# Altium schematic sheet 1_Power.SchDoc
size A4; SheetNumber: 2; SheetTotal: 6
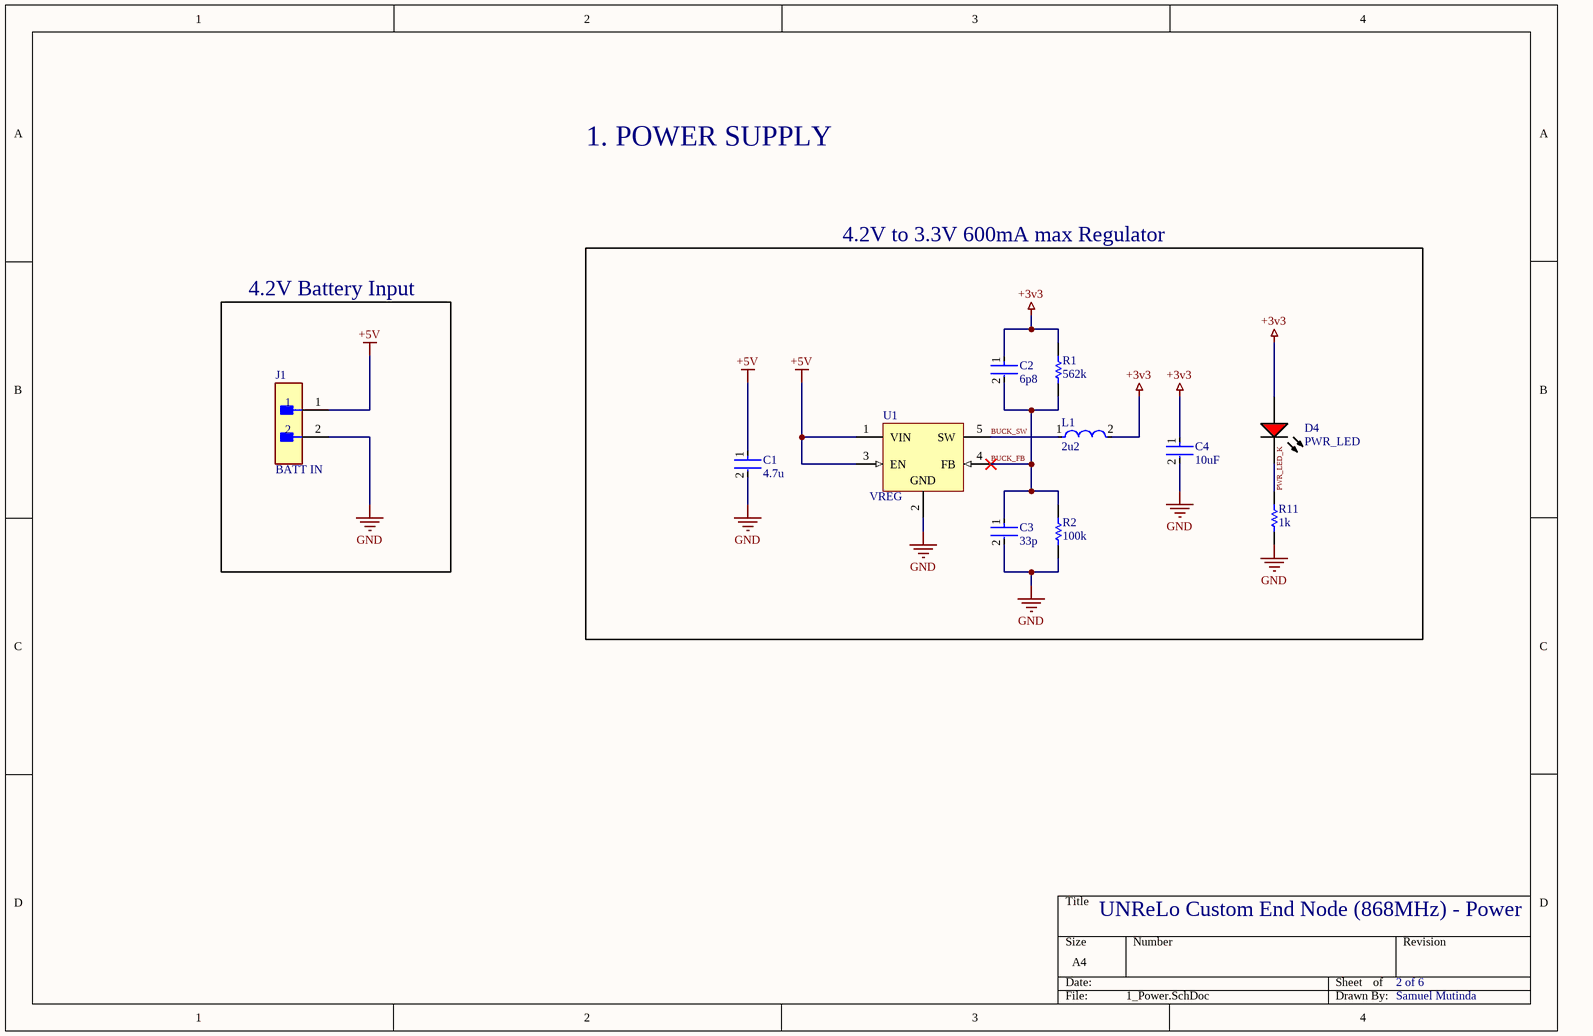
[diagram p0: 1_Power.SchDoc]

## Parts
C1  4.7u  [FP-GRM155-0_1-IPC_B]
C2  6p8  [FP-C0603C-CF-MFG]
C3  33p  [FP-CC0603-0_9-IPC_C]
C4  10uF  [FP-GRM188-0_1-e0_2_0_55-IPC_A]
D4  PWR_LED  [VISH-TLMS1000_V]
J1  BATT IN  [FP-53254-0270-MFG]
L1  2u2  [FP-LQM21PH_G0-IPC_C]
R1  562k  [RESC1609X50X30NL10T20]
R2  100k  [RESC1608X55X30ML20T20]
R11  1k  [RESC1005X40X25NL05T05]
U1  VREG  [DBV0005A_L]

## Blocks framed on the sheet
4.2V Battery Input: J1
4.2V to 3.3V 600mA max Regulator: C1-C4 D4 L1 R1 R2 R11 U1

## Nets
+3v3: C2.1 C4.1 D4.1(A) L1.2 R1.2
+5V: C1.1 J1.1 U1.1(VIN) U1.3(EN)
GND: C1.2 C3.2 C4.2 J1.2 R2.1 R11.1 U1.2(GND)
BUCK_FB: C2.2 C3.1 R1.1 R2.2 U1.4(FB)
BUCK_SW: L1.1 U1.5(SW)
PWR_LED_K: D4.2(K) R11.2

## Notes on the sheet
- 1. POWER SUPPLY
- UNReLo Custom End Node (868MHz) - Power
- 2 of 6
- Samuel Mutinda

## Library data of the parts
C1 = CMP-2008-04549-2: Chip Multilayer Ceramic Capacitors for General Purpose, 0402, 4.7uF, X5R, 15%, 20%, 6.3V; Manufacturer 1: Samsung Electro-Mechanics; Voltage Rating (DC): 16V; Name: CL05A475MO5NUNC; Height: 0.5mm; Weight: 0.000212oz; Length: 1mm; Case Code (Metric): 1005; Packaging: Tape and Reel; Termination: SMD/SMT; Dielectric: X5R; Depth: 0.5mm; Case Code (Imperial): 0402; Min Operating Temperature: -55°C; Case/Package: 0402; Voltage: 6.3V; Width: 0.02inch; Capacitance: 4.7uF; Lead Free: Lead Free; Thickness: 0.022inch; Contact Plating: Tin; REACH SVHC: No SVHC; Package Quantity: 10000; Tolerance: 20%; Voltage Rating: 16V; Mount: Surface Mount; Max Operating Temperature: 85°C; Manufacturer Part Number 1: CL05A475MO5NUNC; Supplier 1: Digi-Key; Supplier Part Number 1: 1276-6836-1-ND; Supplier Unit Price 1: $0.44
C2 = CMP-2006-03271-2: CAP CER 6.8PF 50V NP0 0603; Manufacturer Part Number: C0603C689C5GACTU; Manufacturer: KEMET; Manufacturer 1: TDK Corporation; Manufacturer Part Number 1: C1608CH2A6R8D080AA; Automotive Grade: Grade 1; Temperature Coefficient: 30ppm/°C; Temperature Characteristic: C0G; Tolerance: 0.25 pF; Material: Ceramic; Voltage Rating: 100 V; ComponentLink2URL: https://api.kemet.com/component-edge/download/datasheet/C0603C100J5GACAUTO.pdf; Mouser Description: 0603 C 6.8pF Ceramic Multilayer Capacitor; 50V dc; +125C; C0G Dielectric; +/-0.25pF; Temperature Range High: +125°C; Device Class L1: Passive Components; Temperature: -55°C to +125°C; Digikey Description: CAP CER 6.8PF 50V NP0 0603; Device Class L2: Capacitors; Automotive: Yes; Octopart: https://octopart.com/c0603c689c5gactu-kemet-8718591; Category: Cap; ComponentLink2Description: Datasheet; RoHS: TRUE; Capacitance: 6.8 pF; Value: 6.8 pF; Lead Free: Yes; Device Class L3: Ceramic Capacitors; Package: C0603C-CF; Temperature Range Low: -55°C; Height: 0.87mm; Supplier 1: Digi-Key; Supplier Unit Price 1: $0.14; Supplier Part Number 1: 445-11157-1-ND; Name: C1608CH2A6R8D080AA
C3 = CMP-2000-06072-2: CAP CER 33PF 50V C0G/NPO 0603; Manufacturer 1: KEMET; Manufacturer Part Number 1: C0603H330J5GAC7867; Tolerance: 5%; Temperature Coefficient: 30ppm/°C; Dielectric: C0G; Insulation Resistance: 100GR; Dielectric Material: Ceramic; Voltage Rating (DC): 50V; Capacitance: 33pF; Voltage: 50V; Resistor Type: Ceramic; Lead Free: Lead Free; Mount: Surface Mount; Case Code (Imperial): 0603; Min Operating Temperature: -55°C; Package Quantity: 1; Case Code (Metric): 1608; Radiation Hardening: No; Packaging: Tape and Reel; Length: 1.6mm; Width: 0.031inch; Termination: SMD/SMT; Max Operating Temperature: 125°C; Series: CC; Case/Package: 0603; RoHS Compliant: Yes; Number of Pins: 2; REACH SVHC: No SVHC; Thickness: 0.035inch; Depth: 0.8mm; Voltage Rating: 50V; Height: 0.8mm; Supplier 1: Digi-Key; Supplier Unit Price 1: 0.76; Supplier Part Number 1: 399-17603-1-ND; Name: C0603H330J5GAC7867
C4 = CMP-2006-02792-2: 10 µF ±10% 10V Ceramic Capacitor X5R 0603 (1608 Metric); Manufacturer 1: Murata Electronics; Manufacturer Part Number 1: GRT188R61A106KE13D; Voltage: 6.3V; Tolerance: 20%; Packaging: Tape and Reel; Voltage Rating (DC): 10V; Width: 0.031inch; Termination: SMD/SMT; Dielectric: X5R; Package Quantity: 4000; Voltage Rating: 10V; Capacitance: 10uF; Case/Package: 0603; Min Operating Temperature: -55°C; Length: 1.6mm; Thickness: 0.035inch; Lead Free: Lead Free; Depth: 0.8mm; Case Code (Imperial): 0603; Max Operating Temperature: 85°C; Material: Ceramic; Height: 0.8mm; Mount: Surface Mount; REACH SVHC: No SVHC; Radiation Hardening: No; Case Code (Metric): 1608; Supplier 1: Digi-Key; Supplier Unit Price 1: $0.36; Supplier Part Number 1: 490-12311-1-ND; Name: GRT188R61A106KE13D
D4 = CMP-2000-07254-1: Low Current LED, 40 mW, 1.8 V, -40 to 100 degC, 2-Pin SMD (0603), RoHS, Tape and Reel; Manufacturer: Vishay; Lens Shape: Rectangular; Automotive Qualification Standard: AEC-Q100; Wavelength Typ: 636nm; SVHC: ToBeAdvised; LED Colour: Red; Bulb Size: 1.6mmx0.8mm; Forward Voltage: 1.8V; Luminous Intensity: 4mcd; Forward Current If: 2mA; Viewing Angle: 80°; JLCPCB Part #: C2286; Datasheet URL: https://datasheet.ciiva.com/5798/1698881-5798337.pdf; LED Mounting: SMD; Packaging: CutTape; Package Reference: TLMS1000; Manufacturer URL: http://www.vishay.com/; Mounting Technology: SurfaceMount; Product Range: -; Package Description: 2-Pin Surface Mount Device, Body 1.6 x 0.8 mm; MSL: MSL2-1year
J1 = CMP-04776-000342-1: CONN HEADER R/A 2POS 2MM; Manufacturer 1: Sullins Connector Solutions; Max Current Rating: 3A; Max Voltage Rating (DC): 250V; Number of Positions: 2; Voltage Rating: 125V; Contact Resistance: 20mR; Gender: Male; Current Rating: 2A; Glow Wire Compliant: Non-compliant; Name: SWR201-NRTN-S02-RL-WH; Series: 53254; Packaging: Tray; Max Operating Temperature: 105°C; Depth: 13.59mm; Contact Plating: Tin; Orientation: Right Angle; Number of Circuits: 2; Number of Contacts: 2; Termination: Through Hole; Radiation Hardening: No; Max Voltage Rating (AC): 125V; Min Operating Temperature: -40°C; Housing Material: Nylon; Housing Color: Black; RoHS Compliant: Yes; Number of Rows: 1; Length: 11.07mm; Package Quantity: 2000; Contact Material: Brass; Mount: Through Hole; Contact Gender: Male; Pitch: 2mm; Height: 6.99mm; Manufacturer Part Number 1: SWR201-NRTN-S02-RL-WH; Supplier 1: Digi-Key; Supplier Part Number 1: S9443-ND; Supplier Unit Price 1: $0.13
L1 = CMP-06042-016317-1: 2.2 µH Unshielded Multilayer Inductor 900 mA 170mOhm Max 0806 (2016 Metric); Manufacturer 1: Walsin Technology Corporation; Manufacturer Part Number 1: WLFM201209M2R2PC; Test Frequency: 1MHz; Inductance Tolerance: 30%; Current Rating: 800mA; Self Resonant Frequency: 40MHz; Core Material: Ferrite; Inductance: 2.2uH; DC Resistance (DCR): 288mR; RoHS Compliant: Yes; REACH SVHC: No SVHC; Package Quantity: 4000; Military Standard: Not; Max Operating Temperature: 125°C; Radiation Hardening: No; Series: LQM; Height - Seated (Max): 0.039inch; Tolerance: 30%; Shielding: Shielded; Height: 0.9mm; Lead Free: Lead Free; Case Code (Metric): 2012; Packaging: Tape and Reel; Termination: SMD/SMT; Case Code (Imperial): 0805; Min Operating Temperature: -55°C; Depth: 1.4mm; Mount: Surface Mount; Length: 2mm; DC Current: 800mA; Case/Package: 0805; Max DC Current: 800mA; Width: 0.049inch; Supplier 1: Digi-Key; Supplier Unit Price 1: 0.1; Supplier Part Number 1: 1292-WLFM201209M2R2PCCT-ND; Name: WLFM201209M2R2PC
R1 = CMP-2000-03465-1: Manufacturer 1: Vishay Dale; Manufacturer Part Number 1: CRCW0603562KFKEA; Supplier 1: Digi-Key; Supplier Unit Price 1: $0.1; Supplier Part Number 1: 541-562KHCT-ND; Parameter 1: *; Name: CRCW0603562KFKEA
R2 = CMP-2000-00875-1: 100 kOhms ±0.1% 0.1W, 1/10W Chip Resistor 0603 (1608 Metric) Automotive AEC-Q200 Thin Film; Manufacturer 1: Panasonic Electronic Components; Name: ERA-3AEB104V; Supplier 1: Digi-Key; Manufacturer Part Number 1: ERA-3AEB104V; Supplier Unit Price 1: $0.35; Supplier Part Number 1: P100KDBCT-ND
R11 = CMP-1011-00510-4: Chip Resistor, 1 KOhm, +/- 1%, 100 mW, -55 to 155 degC, 0402 (1005 Metric), RoHS, Tape and Reel; Manufacturer 1: Panasonic Electronic Components; Manufacturer Part Number 1: ERJ-2RKF1001X; Voltage Rating: 50 V; Case\/Package: 0402; Resistance: 1 KOhm; Power Rating: 100 mW; DatasheetVersion: 04/2015; Radiation Hardening: No; Pins: 2; Height: 0.35 mm; RoHSCompliant: true; Case Code (Imperial): 0402; ComponentLink2Description: Datasheet; ComponentLink1Description: Manufacturer URL; PackageReference: 0402; Mount: Surface Mount; Package Quantity: 10000; Tolerance: 1%; ComponentLink1URL: http://www.panasonic.com/; PackageDescription: 2-Pin Surface Mount Device, Body 1 x 0.5 mm; Mounting Technology: Surface Mount; Case Code (Metric): 1005; ComponentLink2URL: http://industrial.panasonic.com/cdbs/www-data/pdf/RDA0000/AOA0000C86.pdf; REACH SVHC: Yes; Packaging: Tape and Reel; Max Operating Temperature: 155 degC; Min Operating Temperature: -55 degC; Width: 0.5 mm; Length: 1 mm; Supplier 1: Digi-Key; Supplier Unit Price 1: $0.1; Supplier Part Number 1: P1.00KLCT-ND; Name: ERJ-2RKF1001X
U1 = CMP-0063-01053-3: 2MHz, 600mA Step-Down DC-DC Converter, 5-pin SOT-23, Pb-Free; Manufacturer: Texas Instruments; Manufacturer Part Number 1: LM3674MF-ADJ/NOPB; PackageTopMarking: SLTB*XTT; PowerWise: Y; CompType: MiscPower; ComponentLink1URL: http://www.ti.com/general/docs/lit/getliterature.tsp?genericPartNumber=LM3674&fileType=pdf; RoHS: Y; PinCount: 5; PackageReference: DBV0005A; PackageDescription: Molded SOT-23, .115 x .063 x .040 in Body, 5 Lead, .0375 in Pitch; ComponentLink1Description: Datasheet URL; Name: LM3674MF-ADJ/NOPB; Supplier Part Number 1: LM3674MF-ADJ/NOPBCT-ND; Supplier Unit Price 1: $1.74; Supplier 1: Digi-Key